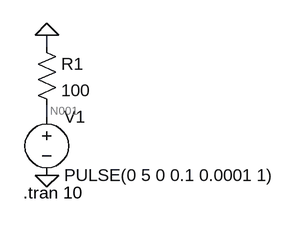
[diagram p0: schematic Draft6.asc]
Draft6.asc, the LTspice schematic file:
Version 4.1
SHEET 1 880 680
WIRE 0 0 0 -16
WIRE 0 96 0 80
FLAG 0 176 0
FLAG 0 -16 0
SYMBOL voltage 0 80 R0
WINDOW 123 0 0 Left 0
WINDOW 39 0 0 Left 0
SYMATTR InstName V1
SYMATTR Value PULSE(0 5 0 0.1 0.0001 1)
SYMBOL res -16 -16 R0
SYMATTR InstName R1
SYMATTR Value 100
TEXT -32 200 Left 2 !.tran 10

The netlist it stands for:
* Draft6.asc
V1 N001 0 PULSE(0 5 0 0.1 0.0001 1)
R1 0 N001 100
.tran 10
.backanno
.end

* Results of the author's LTspice run, read from the files saved beside the schematic
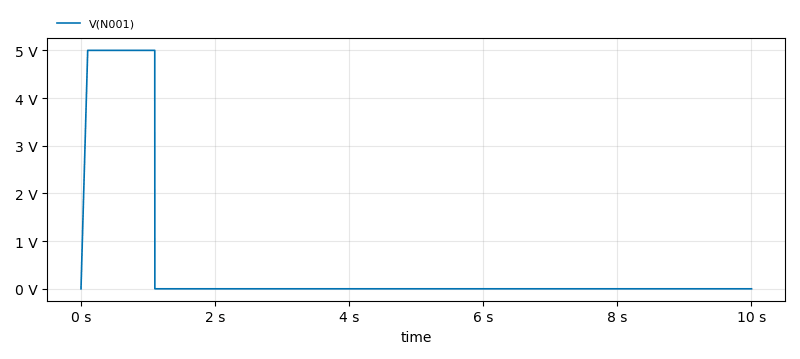
[diagram p1: Transient Analysis of Draft6.asc, plotted from the saved traces]
* Transient Analysis, 1 run:
*   V(N001): min 0 V, max 5 V, average 525 mV, rms 1.607 V, last 0 V